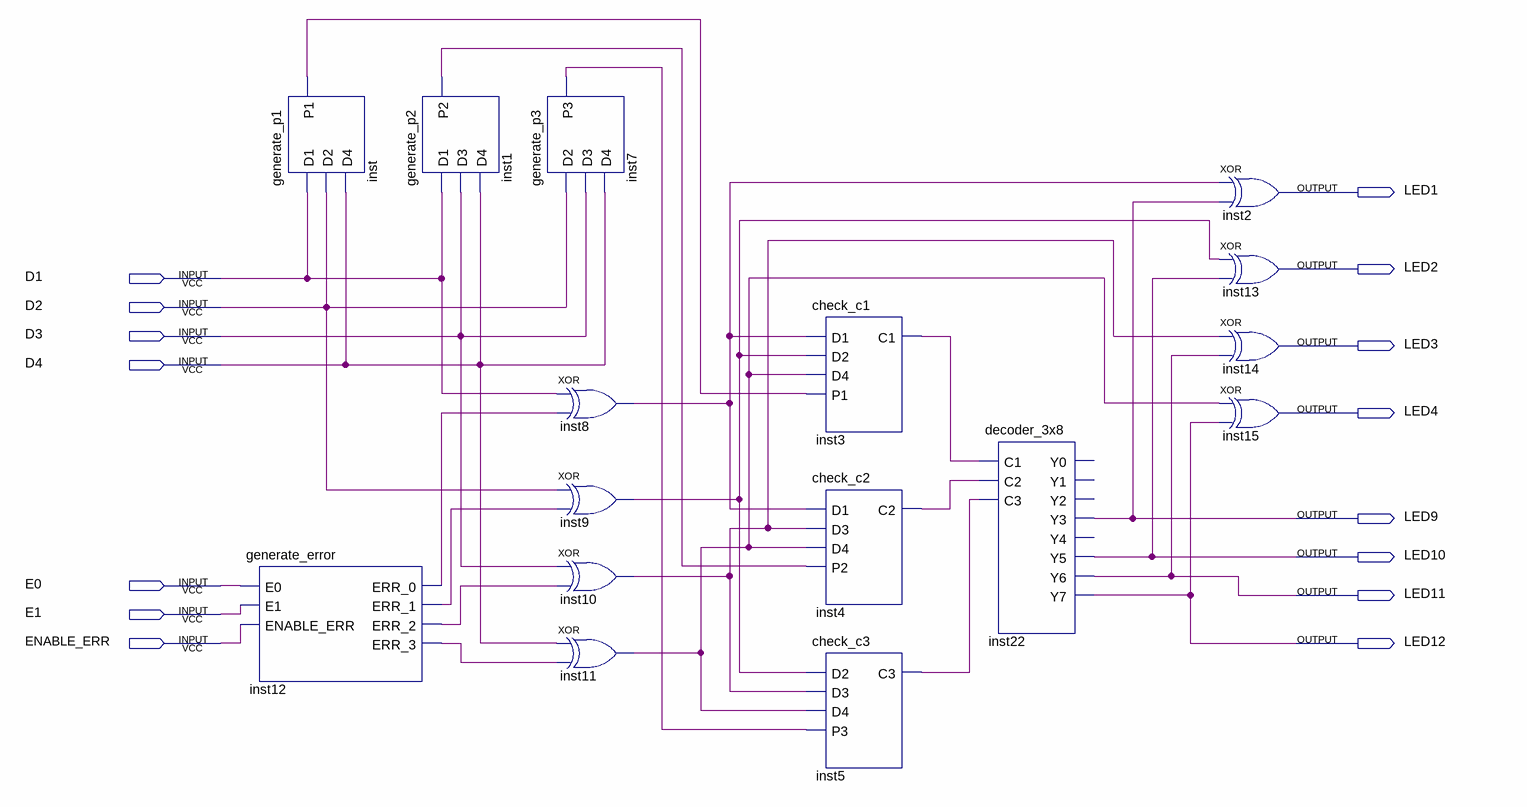
[diagram p0: schematic sheet]
// Quartus schematic pbl01.bdf as structural Verilog: 16 symbols, 15 pins
module pbl01 (
  input  D1,
  input  D2,
  input  D3,
  input  D4,
  input  E0,
  input  E1,
  input  ENABLE_ERR,
  output LED1,
  output LED2,
  output LED3,
  output LED4,
  output LED9,
  output LED10,
  output LED11,
  output LED12
);

  wire inst1_p2, inst3_c1, inst4_c2, inst5_c3, inst7_p3, inst8_out, inst9_out, inst10_out, inst11_out,
       inst12_err_0, inst12_err_1, inst12_err_2, inst12_err_3, inst_p1;

  generate_p1 inst (.D1(D1), .D2(D2), .D4(D4), .P1(inst_p1));
  generate_error inst12 (
    .E0(E0), .E1(E1), .ENABLE_ERR(ENABLE_ERR), .ERR_0(inst12_err_0), .ERR_1(inst12_err_1),
    .ERR_2(inst12_err_2), .ERR_3(inst12_err_3));
  generate_p2 inst1 (.D1(D1), .D3(D3), .D4(D4), .P2(inst1_p2));
  generate_p3 inst7 (.D2(D2), .D3(D3), .D4(D4), .P3(inst7_p3));
  xor inst8 (inst8_out, D1, inst12_err_0);
  xor inst9 (inst9_out, D2, inst12_err_1);
  xor inst10 (inst10_out, D3, inst12_err_2);
  xor inst11 (inst11_out, D4, inst12_err_3);
  check_c1 inst3 (.D1(inst8_out), .D2(inst9_out), .D4(inst11_out), .P1(inst_p1), .C1(inst3_c1));
  check_c2 inst4 (.D1(inst8_out), .D3(inst10_out), .D4(inst11_out), .P2(inst1_p2), .C2(inst4_c2));
  check_c3 inst5 (.D2(inst9_out), .D3(inst10_out), .D4(inst11_out), .P3(inst7_p3), .C3(inst5_c3));
  decoder_3x8 inst22 (
    .C1(inst3_c1), .C2(inst4_c2), .C3(inst5_c3), .Y3(LED9), .Y5(LED10), .Y6(LED11), .Y7(LED12));  // open: Y0, Y1, Y2, Y4
  xor inst2 (LED1, inst8_out, LED9);
  xor inst13 (LED2, inst9_out, LED10);
  xor inst14 (LED3, inst10_out, LED11);
  xor inst15 (LED4, inst11_out, LED12);
endmodule
